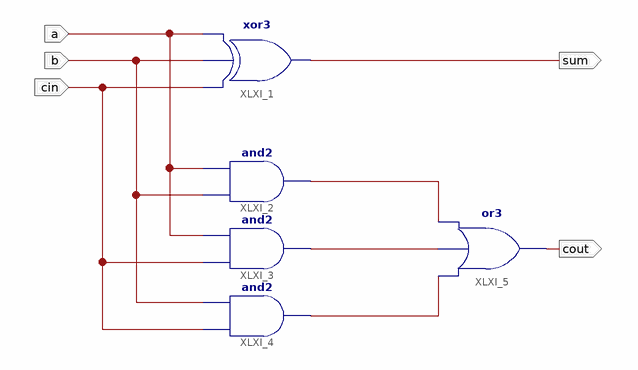
[diagram p0: schematic sheet 1]
// Xilinx ISE schematic fa.sch (xc9500) as structural Verilog: 5 symbols, 5 ports
module fa (
  input  a,
  input  b,
  input  cin,
  output sum,
  output cout
);

  wire XLXN_12, XLXN_13, XLXN_14;

  xor XLXI_1 (sum, cin, b, a);
  and XLXI_2 (XLXN_12, b, a);
  and XLXI_3 (XLXN_13, cin, a);
  and XLXI_4 (XLXN_14, cin, b);
  or XLXI_5 (cout, XLXN_14, XLXN_13, XLXN_12);
endmodule
